# EAGLE board DAWA-MAIN-7.0 (EAGLE 9.5.0)
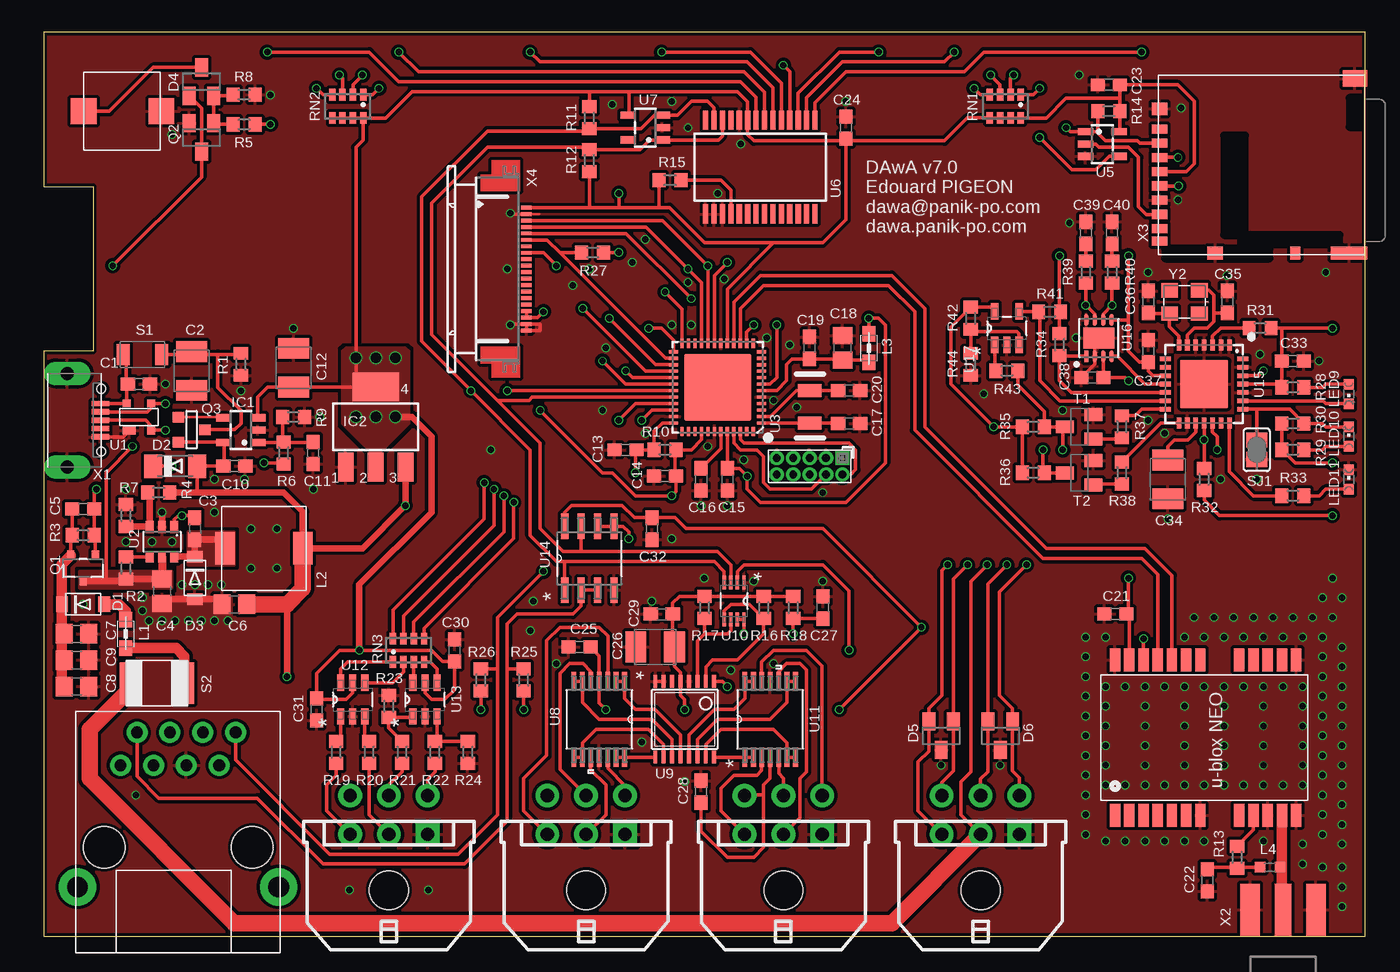
[diagram p5: board, top side]
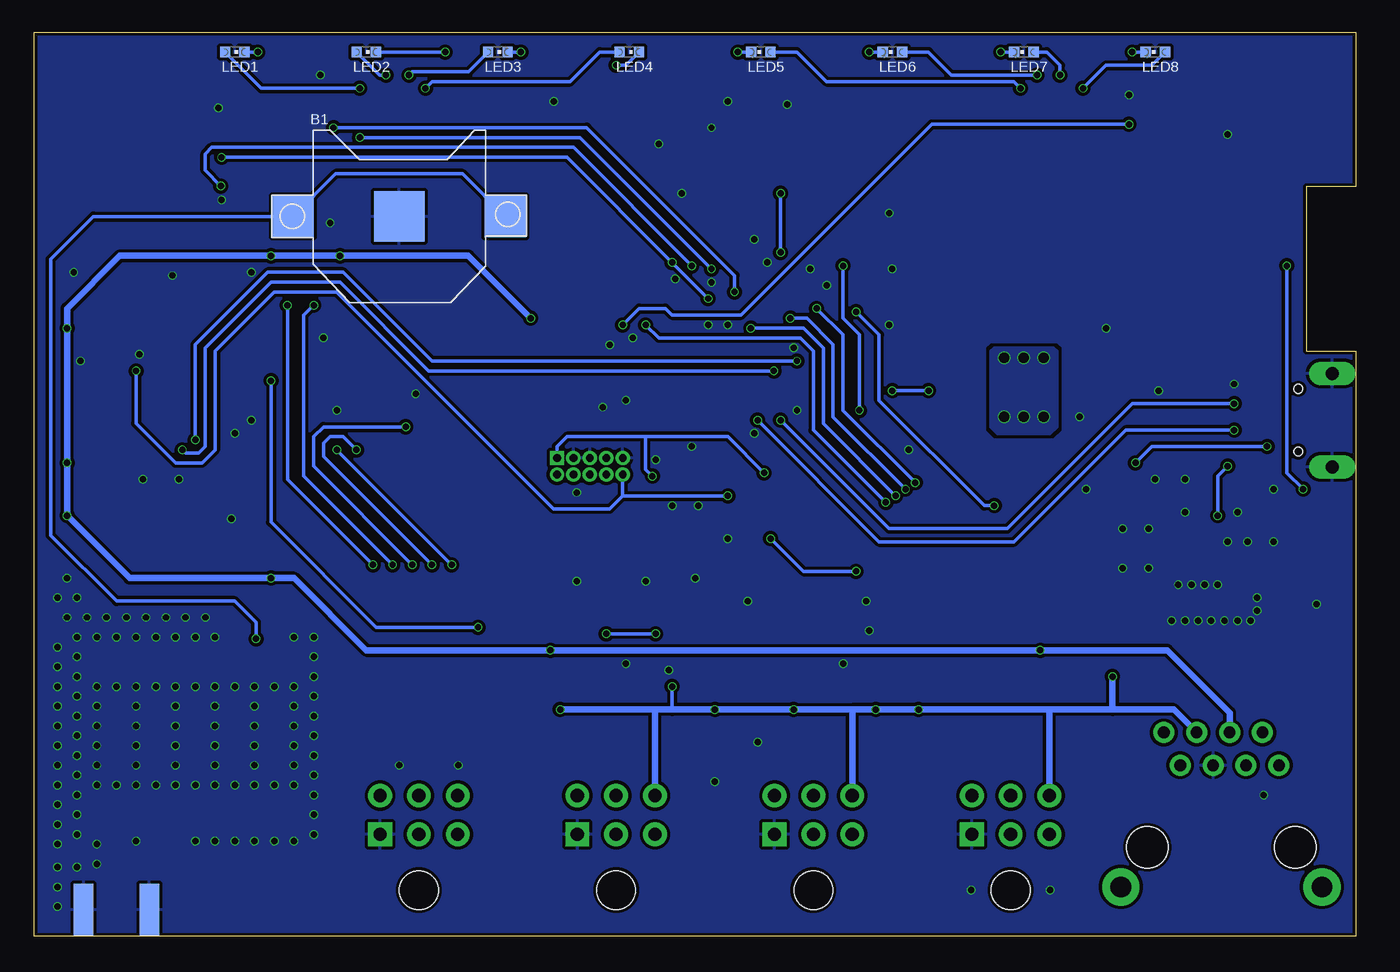
[diagram p6: board, bottom side, seen from below]

Size 102.11 x 69.85 mm. Coordinates in mm from the lower left corner, seen from the top.
Outline: 0,0 102.11,0 102.11,69.85 0,69.85 0,57.91 3.81,57.91 3.81,45.21 0,45.21 0,0
Copper layers (1*16): Top 0.035mm / dielectric 1.6mm / Bottom 0.035mm
Design rules "jlcpcb-2layers": minimum track width 5mil, minimum drill 0.3mm, track to track 5mil, track to pad 5mil, pad to pad 5mil, via to via 5mil, smd to smd 5mil, copper to edge 0.2mm, drill to drill 6mil, minimum pad ring 10mil, minimum via ring 3mil, stop-mask expansion 4mil, vias tented up to drill 0mil, thermal gap 10mil
Net classes: 0 default: width 0.203 mm, drill 0.406 mm, clearance 0.203 mm; 3 usbvcc: width 0.203 mm, drill 0.406 mm, clearance 0.203 mm; 4 USBpair: width 0.254 mm, drill 0.406 mm, clearance 0.61 mm

## Footprints (pad centres in the part's own frame; a part is rotated, then mirrored left to right if it is on the bottom)
CR1220-SMD = smd 3.2 x 3.2: +$1 -8.2,0; +$2 8.2,0 | smd 3.9 x 3.9: - 0,0
C0603 = smd 1.1 x 1: 1 -0.85,0; 2 0.85,0
SMC_B = smd 1.6 x 2.4: + -1.5,0; - 1.5,0
C0805 = smd 1.3 x 1.5: 1 -0.95,0; 2 0.95,0
SOD-123FL = smd 0.91 x 1.22: A 1.637,0; C -1.637,0
MINIMELF = smd 1.4 x 1.8: A 1.7,0; C -1.7,0
SOT23 = smd 1 x 1.4: 1 -0.95,-1.1; 2 0.95,-1.1; 3 0,1.1
SOT23-5 = smd 0.55 x 1.2: 1 -0.95,-1.3; 2 0,-1.3; 3 0.95,-1.3; 4 0.95,1.3; 5 -0.95,1.3
SOT223 = smd 1.219 x 2.235: 1 -2.311,-3.099; 2 0,-3.099; 3 2.311,-3.099 | smd 3.6 x 2.2: 4 0,3.099
ARDUINO_WIFI_SHIELD_V018_TG_PINHEAD_2X05_127 = drill 0.6 pad 1.016 square: 1 -0.635,2.54 | drill 0.6 pad 1.016: 2 0.635,2.54; 3 -0.635,1.27; 4 0.635,1.27; 5 -0.635,0; 6 0.635,0; 7 -0.635,-1.27; 8 0.635,-1.27; 9 -0.635,-2.54; 10 0.635,-2.54
WUERTH-ELEKTRONIK_0805 = smd 1.2 x 1: 1 -1.1,0; 2 1.1,0
SRR0604 = smd 1.5 x 2.5: P$1 3,0; P$2 -3,0
RC-MASTER-SMD_L0603 = smd 0.8 x 0.8: 1 -0.762,0; 2 0.762,0
CHIPLED_0603 = smd 0.8 x 0.8: A 0,-0.75; C 0,0.75
VISHAY_SI2369DS-T1-GE3_0 = smd 0.559 x 0.724: 1 -0.95,-0.984; 2 0.95,-0.984; 3 0,0.984
SOT-23 = smd 0.787 x 0.889: 1 0.025,-1.016; 2 -0.94,1.016; 3 0.991,1.016
R0603 = smd 1 x 1.1: 1 -0.85,0; 2 0.85,0
742-8NS = smd 0.5 x 0.9: 1 -1.2,-0.9; 2 -0.4,-0.9; 3 0.4,-0.9; 4 1.2,-0.9; 5 1.2,0.9; 6 0.4,0.9; 7 -0.4,0.9; 8 -1.2,0.9
MF-1206 = smd 1 x 1.6: 1 -2,0; 2 1,0
MF-1812 = smd 1.5 x 3.2: 1 -1,0; 2 3.25,0
SKPMAPE10 = smd 2 x 2: P$1 -3,0; P$2 3,0
SJ = smd 1.168 x 1.6: 1 -0.762,0; 2 0.762,0
SOT23-BEC = smd 1 x 1.4: B -0.95,-1.1; C 0,1.1; E 0.95,-1.1
SOT-143B = smd 1 x 0.6: 1 -0.75,-1.05 | smd 0.6 x 0.6: 2 0.95,-1.05; 3 0.95,1.05; 4 -0.95,1.05
SOT23-6 = smd 0.6 x 0.9: 1 -0.95,-1.15; 2 0,-1.15; 3 0.95,-1.15; 4 0.95,1.15; 5 0,1.15; 6 -0.95,1.15
QFN-48 = smd 0.7 x 0.25: 1 -3.4,2.75; 2 -3.4,2.25; 3 -3.4,1.75; 4 -3.4,1.25; 5 -3.4,0.75; 6 -3.4,0.25; 7 -3.4,-0.25; 8 -3.4,-0.75; 9 -3.4,-1.25; 10 -3.4,-1.75; 11 -3.4,-2.25; 12 -3.4,-2.75; 25 3.4,-2.75; 26 3.4,-2.25; 27 3.4,-1.75; 28 3.4,-1.25; 29 3.4,-0.75; 30 3.4,-0.25; 31 3.4,0.25; 32 3.4,0.75; 33 3.4,1.25; 34 3.4,1.75; 35 3.4,2.25; 36 3.4,2.75 | smd 0.25 x 0.7: 13 -2.75,-3.4; 14 -2.25,-3.4; 15 -1.75,-3.4; 16 -1.25,-3.4; 17 -0.75,-3.4; 18 -0.25,-3.4; 19 0.25,-3.4; 20 0.75,-3.4; 21 1.25,-3.4; 22 1.75,-3.4; 23 2.25,-3.4; 24 2.75,-3.4; 37 2.75,3.4; 38 2.25,3.4; 39 1.75,3.4; 40 1.25,3.4; 41 0.75,3.4; 42 0.25,3.4; 43 -0.25,3.4; 44 -0.75,3.4; 45 -1.25,3.4; 46 -1.75,3.4; 47 -2.25,3.4; 48 -2.75,3.4 | smd 5.15 x 5.15: EP 0,0
NEO-M8 = smd 1.8 x 0.8: 1 6.4,-7.4; 2 6.4,-6.3; 3 6.4,-5.2; 4 6.4,-4.1; 5 6.4,-3; 6 6.4,-1.9; 7 6.4,-0.8; 8 6.4,2.2; 9 6.4,3.3; 10 6.4,4.4; 11 6.4,5.5; 12 6.4,6.6; 13 -5.6,6.6; 14 -5.6,5.5; 15 -5.6,4.4; 16 -5.6,3.3; 17 -5.6,2.2; 18 -5.6,-0.8; 19 -5.6,-1.9; 20 -5.6,-3; 21 -5.6,-4.1; 22 -5.6,-5.2; 23 -5.6,-6.3; 24 -5.6,-7.4
SSOP28 = smd 0.4 x 1.5: 1 -4.225,-3.625; 2 -3.575,-3.625; 3 -2.925,-3.625; 4 -2.275,-3.625; 5 -1.625,-3.625; 6 -0.975,-3.625; 7 -0.325,-3.625; 8 0.325,-3.625; 9 0.975,-3.625; 10 1.625,-3.625; 11 2.275,-3.625; 12 2.925,-3.625; 13 3.575,-3.625; 14 4.225,-3.625; 15 4.225,3.625; 16 3.575,3.625; 17 2.925,3.625; 18 2.275,3.625; 19 1.625,3.625; 20 0.975,3.625; 21 0.325,3.625; 22 -0.325,3.625; 23 -0.975,3.625; 24 -1.625,3.625; 25 -2.275,3.625; 26 -2.925,3.625; 27 -3.575,3.625; 28 -4.225,3.625
SOP65P640X120-14N = smd 1.473 x 0.356: 1 -2.921,1.956; 2 -2.921,1.295; 3 -2.921,0.66; 4 -2.921,0; 5 -2.921,-0.66; 6 -2.921,-1.295; 7 -2.921,-1.956; 8 2.921,-1.956; 9 2.921,-1.295; 10 2.921,-0.66; 11 2.921,0; 12 2.921,0.66; 13 2.921,1.295; 14 2.921,1.956
ADC12_SD = smd 0.305 x 0.991: 1 -2.275,-2.918; 2 -1.625,-2.918; 3 -0.975,-2.918; 4 -0.325,-2.918; 5 0.325,-2.918; 6 0.975,-2.918; 7 1.625,-2.918; 8 2.275,-2.918; 9 2.275,2.918; 10 1.625,2.918; 11 0.975,2.918; 12 0.325,2.918; 13 -0.325,2.918; 14 -0.975,2.918; 15 -1.625,2.918; 16 -2.275,2.918
SOP50P310X90-8N = smd 1.067 x 0.254: 1 -1.422,0.762; 2 -1.422,0.254; 3 -1.422,-0.254; 4 -1.422,-0.762; 5 1.422,-0.762; 6 1.422,-0.254; 7 1.422,0.254; 8 1.422,0.762
SOT95P280X145-6N = smd 1.27 x 0.559: 1 -1.295,0.94; 2 -1.295,0; 3 -1.295,-0.94; 4 1.295,-0.94; 5 1.295,0; 6 1.295,0.94
SOIC127P600X175-8N = smd 1.981 x 0.559: 1 -2.464,1.905; 2 -2.464,0.635; 3 -2.464,-0.635; 4 -2.464,-1.905; 5 2.464,-1.905; 6 2.464,-0.635; 7 2.464,0.635; 8 2.464,1.905
QFN-28-S = smd 0.85 x 0.35: 1 -3,1.95; 2 -3,1.3; 3 -3,0.65; 4 -3,0; 5 -3,-0.65; 6 -3,-1.3; 7 -3,-1.95; 15 3,-1.95; 16 3,-1.3; 17 3,-0.65; 18 3,0; 19 3,0.65; 20 3,1.3; 21 3,1.95 | smd 0.35 x 0.85: 8 -1.95,-3; 9 -1.3,-3; 10 -0.65,-3; 11 0,-3; 12 0.65,-3; 13 1.3,-3; 14 1.95,-3; 22 1.95,3; 23 1.3,3; 24 0.65,3; 25 0,3; 26 -0.65,3; 27 -1.3,3; 28 -1.95,3 | smd 3.7 x 3.7: EXP 0,0
MICROCHIP_MCP2562T-E-MF_2 = smd 0.906 x 0.292: 1 -1.403,0.975; 2 -1.403,0.325; 3 -1.403,-0.325; 4 -1.403,-0.975; 5 1.403,-0.975; 6 1.403,-0.325; 7 1.403,0.325; 8 1.403,0.975 | smd 1.6 x 2.4: 9 0,0
SOT95P280X145-5N = smd 1.27 x 0.559: 1 -1.295,0.94; 2 -1.295,0; 3 -1.295,-0.94; 4 1.295,-0.94; 5 1.295,0.94
USB-MINIB-DAWA = smd 0.406 x 1.372: D+ 0,4.381; D- -0.641,4.381; GND 1.282,4.381; ID 0.641,4.381; VBUS -1.282,4.381 | drill 1 long: GND1 -3.612,1.826; GND2 3.612,1.826 | hole 0.7: -2.421,4.445; 2.421,4.445
SMA_EDGELAUNCH = smd 4.064 x 1.524: GND@1 2.032,-2.54; GND@2 2.032,2.54 | smd 4.064 x 1.524 bottom: GND@3 2.032,2.54; GND@4 2.032,-2.54 | smd 4.064 x 1.27: P 2.032,0
DM3AT-SF-PEJM5 = smd 0.7 x 1.2: 1 3.2,-0.1; 2 2.1,-0.1; 3 1,-0.1; 4 -0.1,-0.1; 5 -1.2,-0.1; 6 -2.3,-0.1; 7 -3.4,-0.1; 8 -4.5,-0.1; B -5.45,-0.1 | smd 1 x 0.8: A -6.4,-10.6 | smd 1 x 1.2: MOUNT0 4.75,-0.1; MOUNT1 -6.4,-4.4 | smd 1 x 2.8: MOUNT2 -6.4,-14.75 | smd 1.3 x 1.9: MOUNT3 7.1,-15.2
52745-2090 = smd 0.3 x 0.8: 1 -4.75,2.5; 2 -4.25,2.5; 3 -3.75,2.5; 4 -3.25,2.5; 5 -2.75,2.5; 6 -2.25,2.5; 7 -1.75,2.5; 8 -1.25,2.5; 9 -0.75,2.5; 10 -0.25,2.5; 11 0.25,2.5; 12 0.75,2.5; 13 1.25,2.5; 14 1.75,2.5; 15 2.25,2.5; 16 2.75,2.5; 17 3.25,2.5; 18 3.75,2.5; 19 4.25,2.5; 20 4.75,2.5
43045-0600 = drill 1.02 square: P$1 3,4.32 | drill 1.02: P$2 0,4.32; P$3 -3,4.32; P$4 3,7.32; P$5 0,7.32; P$6 -3,7.32 | hole 3: 0,0
RJ45 = drill 1.6: P$1 5.08,0.13; P$2 5.08,15.67 | drill 0.9: P$3 17.02,11.075; P$4 17.02,3.455; P$5 17.02,5.995; P$6 14.48,4.725; P$7 14.48,7.265; P$8 14.48,12.345; P$9 14.48,9.805; P$10 17.02,8.535 | hole 3.2: 8.14,2.185; 8.14,13.615
KANFLO_OSCILLATOR_SMD = smd 1 x 1.8: 1 0,0; 2 2.5,0
3.2X2.5_KX-7 = smd 1.3 x 1.1: 1 -1.15,-0.9; 2 1.15,-0.9; 3 1.15,0.9; 4 -1.15,0.9

## Placement (x,y rotation side)
B1  [CR1220-SMD]  73.91,55.63 0 bottom
C1  10nF  [C0603]  7.37,42.67 0 top
C2  10µF  [SMC_B]  11.43,43.69 270 top
C3  10nF  [C0603]  11.68,31.5 270 top
C4  10µF  [C0805]  9.14,26.67 270 top
C5  10nF  [C0603]  3.05,33.02 0 top
C6  10µF  [C0805]  14.73,25.65 180 top
C7  10µF  [C0805]  2.54,21.34 0 top
C8  10µF  [C0805]  2.54,19.3 0 top
C9  10µF  [C0805]  2.54,23.37 0 top
C10  0.1µF  [C0603]  14.73,36.32 0 top
C11  0.1µF  [C0603]  20.83,37.34 270 top
C12  10µF  [SMC_B]  19.3,43.94 90 top
C13  0.1µF  [C0603]  44.96,37.59 180 top
C14  0.1µF  [C0603]  48.01,35.56 180 top
C15  0.1µF  [C0603]  52.83,35.31 270 top
C16  0.1µF  [C0603]  50.8,35.31 270 top
C17  22pF  [C0603]  62.23,39.62 0 top
C18  10µF  [C0805]  61.72,45.47 90 top
C19  0.1µF  [C0603]  59.18,45.47 90 top
C20  22pF  [C0603]  62.23,42.16 0 top
C21  4.7µF  [C0603]  82.8,24.89 0 top
C22  47pF  [C0603]  89.92,4.32 90 top
C23  0.1µF  [C0603]  82.3,65.79 0 top
C24  0.1µF  [C0603]  61.98,62.48 90 top
C25  0.1µF  [C0603]  41.4,22.35 0 top
C26  1µF  [SMC_B]  47.24,22.35 180 top
C27  100pF  [C0603]  60.2,25.4 90 top
C28  0.1µF  [C0603]  50.8,11.18 90 top
C29  0.1µF  [C0603]  47.75,24.89 180 top
C30  0.1µF  [C0603]  31.75,22.1 90 top
C31  0.1µF  [C0603]  21.08,17.53 270 top
C32  0.1µF  [C0603]  46.99,31.5 270 top
C33  0.1µF  [C0603]  96.52,44.45 0 top
C34  10µF  [SMC_B]  86.87,35.31 270 top
C35  22pF  [C0603]  91.44,49.02 90 top
C36  22pF  [C0603]  85.34,49.02 90 top
C37  1µF  [C0603]  85.34,45.21 90 top
C38  1µF  [C0603]  81.03,43.18 180 top
C39  560pF  [C0603]  80.52,54.36 90 top
C40  560pF  [C0603]  82.55,54.36 90 top
D1  [SOD-123FL]  3.05,25.65 0 top
D2  [MINIMELF]  10.16,36.32 0 top
D3  [SOD-123FL]  11.68,27.69 270 top
D4  BAT54C  [SOT23]  12.19,66.04 0 top
D5  MMBZ27VAL  [SOT23]  69.34,15.49 180 top
D6  PESD1CAN  [SOT23]  73.91,15.49 180 top
IC1  LMV321M5  [SOT23-5]  15.24,39.12 90 top
IC2  NCP1117ST33T3G-3V3  [SOT223]  25.65,39.37 0 top
J1  [ARDUINO_WIFI_SHIELD_V018_TG_PINHEAD_2X05_127]  59.18,36.32 270 top
L1  [WUERTH-ELEKTRONIK_0805]  6.35,23.37 270 top
L2  10u SRR0604-100ML  [SRR0604]  17.02,29.97 180 top
L3  [WUERTH-ELEKTRONIK_0805]  63.75,45.47 90 top
L4  27nH  [RC-MASTER-SMD_L0603]  94.74,5.33 0 top
LED1  [CHIPLED_0603]  86.61,68.33 270 bottom
LED2  [CHIPLED_0603]  76.45,68.33 270 bottom
LED3  [CHIPLED_0603]  66.29,68.33 270 bottom
LED4  [CHIPLED_0603]  56.13,68.33 270 bottom
LED5  [CHIPLED_0603]  45.97,68.33 90 bottom
LED6  [CHIPLED_0603]  35.81,68.33 90 bottom
LED7  [CHIPLED_0603]  25.65,68.33 90 bottom
LED8  [CHIPLED_0603]  15.49,68.33 90 bottom
LED9  [CHIPLED_0603]  100.84,41.91 180 top
LED10  [CHIPLED_0603]  100.84,38.61 0 top
LED11  [CHIPLED_0603]  100.84,35.31 0 top
Q1  SI2369DS-T1-GE3VISHAY_SI2369DS-T1-GE3_0_0  [VISHAY_SI2369DS-T1-GE3_0]  3.05,28.45 180 top
Q2  BSS123  [SOT23]  12.19,61.72 180 top
Q3  FDN340P  [SOT-23]  11.43,39.12 90 top
R1  10k  [R0603]  15.24,44.2 90 top
R2  100k  [R0603]  6.35,28.45 90 top
R3  100k  [R0603]  3.05,30.99 180 top
R4  52k3  [R0603]  8.89,34.29 0 top
R5  330  [R0603]  15.49,62.74 180 top
R6  100k  [R0603]  18.54,37.34 90 top
R7  10k  [R0603]  6.35,32.51 270 top
R8  1M  [R0603]  15.49,65.02 180 top
R9  100k  [R0603]  19.3,40.13 0 top
R10  10k  [R0603]  48.01,37.59 180 top
R11  4.7k  [R0603]  42.16,63.25 90 top
R12  4.7k  [R0603]  42.16,59.94 270 top
R13  10  [R0603]  92.2,6.1 270 top
R14  10k  [R0603]  82.3,63.75 0 top
R15  10k  [R0603]  48.39,58.42 180 top
R16  4.7k  [R0603]  55.63,25.4 270 top
R17  4.7k  [R0603]  51.05,25.4 270 top
R18  200k  [R0603]  57.91,25.4 90 top
R19  4.7k  [R0603]  22.61,14.22 90 top
R20  4.7k  [R0603]  25.15,14.22 90 top
R21  1.8k  [R0603]  27.69,14.22 90 top
R22  1.8k  [R0603]  30.23,14.22 90 top
R23  1k  [R0603]  26.67,17.78 270 top
R24  1k  [R0603]  32.77,14.22 90 top
R25  1k  [R0603]  37.08,19.81 270 top
R26  1k  [R0603]  33.78,19.81 270 top
R27  10k  [R0603]  42.42,52.83 0 top
R28  100  [R0603]  96.52,42.42 0 top
R29  100  [R0603]  96.52,37.59 0 top
R30  100k  [R0603]  96.52,39.62 0 top
R31  100k  [R0603]  93.98,46.99 180 top
R32  1k  [R0603]  89.66,35.31 90 top
R33  100  [R0603]  96.52,34.04 0 top
R34  1k  [R0603]  78.49,45.72 270 top
R35  510 0.5W  [R0603]  76.45,39.37 180 top
R36  510 0.5W  [R0603]  76.45,35.81 180 top
R37  1k  [R0603]  83.31,39.37 270 top
R38  1k  [R0603]  83.31,35.81 270 top
R39  100  [R0603]  80.52,51.31 90 top
R40  100  [R0603]  82.55,51.31 90 top
R41  10k  [R0603]  77.72,48.26 180 top
R42  10k  [R0603]  71.63,47.75 90 top
R43  10k  [R0603]  74.42,43.69 0 top
R44  10k  [R0603]  71.63,44.2 90 top
RN1  100  [742-8NS]  74.3,64.14 180 top
RN2  100  [742-8NS]  23.5,64.14 180 top
RN3  510  [742-8NS]  28.19,22.1 0 top
S1  [MF-1206]  8.13,44.96 0 top
S2  [MF-1812]  7.62,19.56 0 top
S3  SKPMAPE10  [SKPMAPE10]  6.1,63.75 180 top
SJ1  [SJ]  93.73,37.59 90 top
T1  [SOT23-BEC]  80.01,39.37 90 top
T2  [SOT23-BEC]  80.01,35.81 90 top
U1  PRTR5V0U2X  [SOT-143B]  7.37,40.13 0 top
U2  LM2734Y  [SOT23-6]  9.14,30.48 180 top
U3  ATSAMD21G-M  [QFN-48]  52.07,42.42 180 top
U4  NEO-M8  [NEO-M8]  90.17,15.75 270 top
U5  74AHC1G125DBV  [SOT23-5]  81.79,61.21 270 top
U6  MCP23017SS  [SSOP28]  55.37,59.44 180 top
U7  24AA02E48OT  [SOT23-5]  46.48,62.48 90 top
U8  TLV2374IPWR  [SOP65P640X120-14N]  42.93,16.76 270 top
U9  ADC128D818  [ADC12_SD]  49.53,16.76 180 top
U10  PCA9306DCUT  [SOP50P310X90-8N]  53.34,25.91 270 top
U11  TLV2374IPWR  [SOP65P640X120-14N]  56.13,16.76 90 top
U12  SN74LVC2G17DBVR  [SOT95P280X145-6N]  23.88,18.29 90 top
U13  SN74LVC2G17DBVR  [SOT95P280X145-6N]  29.46,18.29 90 top
U14  P82B96D  [SOIC127P600X175-8N]  42.16,29.21 90 top
U15  STN2100  [QFN-28-S]  89.66,42.67 270 top
U16  MCP2562T-E-MFMICROCHIP_MCP2562T-E-MF_0_2  [MICROCHIP_MCP2562T-E-MF_2]  81.53,46.23 90 top
U17  TL331IDBVR  [SOT95P280X145-5N]  74.42,46.99 90 top
X1  [USB-MINIB-DAWA]  0,39.88 270 top
X2  [SMA_EDGELAUNCH]  95.76,0 90 top
X3  DM3AT-SF-PEJM5  [DM3AT-SF-PEJM5]  86.11,59.18 90 top
X4  52745-2090  [52745-2090]  34.8,51.56 270 top
X5  [43045-0600]  57.15,3.56 0 top
X6  RJ45  [RJ45]  18.29,-1.27 90 top
X7  [43045-0600]  72.39,3.56 0 top
X8  [43045-0600]  41.91,3.56 0 top
X9  [43045-0600]  26.67,3.56 0 top
Y1  CM7V-T1A  [KANFLO_OSCILLATOR_SMD]  59.18,42.16 270 top
Y2  16Mhz  [3.2X2.5_KX-7]  88.14,49.02 180 top

## Tracks (layer width: path | path; a pad name or v marks a point on that pad's centre or on a via)
+3V3  (via drill 0.5, 0.8)
  Top 0.254: U13.5 29.46,18.8 29.97,18.29 30.99,18.29 31.75,19.05 C30.1 30.82,21.25 29.97,22.1 v24.38,22.1 22.86,22.1 21.08,20.32 C31.1 21.17,18.29 23.37,18.29 23.88,18.8 U12.5 | U15.25 95.42,42.67 R28.1 C33.1 95.67,46.99 | 83.15,64.77 C23.2 87.63,65.79 88.9,64.52 88.9,59.69 88.29,59.08 X3.4 | 83.15,64.77 R14.2 83.15,62.22 U5.5 | U3.44 C15.1 53.76,36.16 v54.36,35.56 54.36,34.54 55.37,33.53 61.98,33.53 65.02,36.58 65.02,47.24 64.52,47.75 v63.75,47.75 L3.2 | RN2.5 RN2.6 RN2.7 RN2.8 | C24.1 61.81,61.47 54.86,61.47 54.4,61.94 U6.9 54.4,64.47 53.59,65.28 45.21,65.28 | C24.1 62.14,61.47 69.6,61.47 71.37,63.25 RN1.5 RN1.6 RN1.7 RN1.8 77.46,63.23 78.99,64.77 83.15,64.77 | RN2.8 26.41,63.23 28.45,65.28 42.16,65.28 | 45.21,65.28 42.16,65.28 | v99.57,36.58 96.69,36.58 R29.1 R30.1 | v99.57,32.51 90.84,32.51 89.66,33.69 R32.1 | v99.57,46.99 95.67,46.99 | v83.82,52.58 83.82,47.63 | U16.5 83.82,47.63 | R31.1 95.67,46.99 | R34.1 78.49,48.17 R41.1 78.49,48.35 v78.49,52.58 | X4.1 42.16,56.31 | 42.16,56.31 44.45,56.31 | 44.45,56.31 47.54,56.31 | 47.54,56.31 48.34,56.31 51.05,53.59 56.39,53.59 | R15.2 47.54,56.31 | U3.17 52.82,50.03 56.39,53.59 | C24.1 61.98,55.37 60.2,53.59 56.39,53.59 | v44.45,52.83 R27.2 | v44.45,57.4 44.45,56.31 | U10.2 53.59,28.19 54.1,28.7 60.2,28.7 62.23,26.67 v62.23,22.1 | IC1.3 16.54,41.69 17.3,42.44 C12.+ 24.13,42.44 v24.13,44.7 24.13,60.96 24.7,61.52 RN2.8 | U3.36 47.8,39.67 47.16,39.03 R10.2 C13.1 45.72,37.5 v45.72,35.81 | 83.82,47.63 83.82,45.21 84.67,44.36 C37.1 85.34,43.69 85.71,43.32 U15.10 | U4.23 83.87,24.89 C21.2 83.82,24.89 v83.82,27.69 | U7.4 45.21,63.46 45.21,65.28
  Top 0.254: R11.2 42.16,65.28 | R12.2 42.16,56.31
  Top 0.508: v24.38,22.1 24.38,27.18 29.97,32.77 29.97,38.61 28.45,40.13 v27.18,40.13
  Bottom 0.254: v44.45,57.4 v44.45,52.83 | 54.86,38.61 48.51,38.61 v45.72,35.81 | 54.86,38.61 60.96,38.61 61.72,37.85 J1.1 | v54.36,35.56 54.86,36.07 54.86,38.61
  Bottom 0.508: v63.75,47.75 68.58,52.58 v78.49,52.58 v83.82,52.58 95.5,52.58 99.57,48.51 v99.57,46.99 v99.57,36.58 v99.57,32.51 94.74,27.69 v83.82,27.69 82.04,27.69 76.45,22.1 v62.23,22.1 v24.38,22.1 14.58,22.1 9.75,17.27 X6.P$10
  other vias: 25.65,44.7 27.18,44.7 25.65,40.13 24.13,40.13
  pour Top (no thermals): 25.65,37.08 23.11,39.62 23.11,45.21 23.37,45.47 27.94,45.47 28.19,45.21 28.19,39.62
  pour Bottom: 27.94,45.47 23.37,45.47 23.11,45.21 23.11,39.37 23.62,38.86 27.69,38.86 28.19,39.37 28.19,45.21
+5V  (via drill 0.5)
  Top 0.254: Q3.2 IC1.5 13.94,36.32 C10.1 D2.A 11.86,34.29 11.94,34.29 | v52.83,19.3 52.45,19.68 U9.1 | R18.2 R16.1 R17.1 49.11,26.25 48.6,25.74 C29.1 48.6,22.49 C26.+ 48.74,20.85 49.2,20.39 U9.5 49.2,18.61 49.53,18.29 v49.53,17.53 | U16.3 81.86,43.2 C38.1 83.57,43.18 v83.82,42.93 | X4.17 X4.18 37.85,47.81 38.16,47.81 v38.61,48.26 | v43.43,17.53 42.93,18.03 U8.4 42.93,21.68 C25.2 | C28.1 50.8,8.13 52.83,6.1 54.86,6.1 55.63,6.86 55.63,10.92 | v61.47,17.53 v67.82,23.88 60.2,31.5 49.62,31.5 48.77,32.35 C32.1 45.63,32.35 44.7,33.27 40.77,33.27 40.26,32.77 U14.8 | U11.4 56.13,12.19 55.63,11.68 55.63,10.92 | X5.P$6 54.2,10.92 55.63,10.92 | R26.2 v33.78,17.53 | R25.2 v37.08,17.53
  Top 0.508: IC2.3 27.96,33.3 v27.94,33.27 24.64,29.97 L2.P$2 20.02,32.81 18.54,34.29 11.94,34.29 R4.2 | v18.8,20.07 18.8,25.65
  Top 1.27: C6.1 18.8,25.65 20.02,26.88 L2.P$2
  Bottom 0.254: v52.83,19.3 52.83,17.53 | v38.61,48.26 36.83,46.48 36.83,41.4 28.7,33.27 v27.94,33.27 | v83.82,42.93 83.82,32 75.69,23.88 v67.82,23.88
  Bottom 0.508: 38.91,17.53 v43.43,17.53 v49.53,17.53 52.83,17.53 54.15,17.53 | 54.15,17.53 v61.47,17.53 | X8.P$6 38.91,17.53 | X5.P$6 54.15,17.53 | X9.P$6 23.67,17.53 | 23.67,17.53 v33.78,17.53 v37.08,17.53 38.91,17.53 | X6.P$5 14.07,17.53 18.8,17.53 | 18.8,17.53 23.67,17.53 | v18.8,20.07 18.8,17.53
+12V  (via drill 0.5)
  Top 0.254: U17.5 73.48,48.6 R42.2 70.1,47.08 70.1,42.67 v73.41,39.37 R35.2 R36.2 | v72.9,28.7 71.63,27.43 71.63,12.7 70.87,11.94 70.87,9.4 X7.P$2
  Top 1.27: X7.P$2 65.53,1.02 14.73,1.02 3.56,12.19 3.56,15.99 6.62,19.05 S2.1
  Bottom 0.254: v73.41,39.37 79.76,39.37 80.52,38.61 80.52,36.32 v72.9,28.7
ANA_1
  Top 0.254: U11.3 55.47,12.8 55.12,12.45 53.34,12.45 52.32,11.43 52.32,9.7 X5.P$3
ANA_2
  Top 0.254: U11.5 56.79,12.57 57.15,12.22 X5.P$5
ANA_3
  Top 0.254: U11.10 56.79,20.47 57.4,21.08 58.42,21.08 58.93,20.57 58.93,12.7 58.42,12.19 58.42,9.15 X5.P$2
ANA_4
  Top 0.254: U11.12 55.47,21.18 56.39,22.1 58.93,22.1 60.15,20.88 X5.P$4
ANA_5
  Top 0.254: U8.3 43.59,23.22 42.93,23.88 39.88,23.88 38.86,22.86 38.86,13.97 37.08,12.19 37.08,9.7 X8.P$3
ANA_6
  Top 0.254: U8.5 42.27,20.47 41.66,21.08 40.64,21.08 39.88,20.32 39.88,12.91 X8.P$5
ANA_7
  Top 0.254: X8.P$2 43.43,9.4 43.43,11.68 42.27,12.85 U8.10
ANA_8
  Top 0.254: U8.12 43.59,12.96 44.91,11.64 X8.P$4
BOOST  (via drill 0.5)
  Top 0.254: U2.1 10.09,32.19 10.41,32.51 v10.67,32.51 11.52,32.51 C3.1 | v9.91,36.32 D2.C
  Bottom 0.254: v10.67,32.51 10.67,35.56 v9.91,36.32
CAN_HI  (via drill 0.5)
  Top 0.254: R39.1 v80.52,48.77 81.21,48.08 U16.7 | X7.P$5 72.39,12.15 72.96,12.72 D6.2 72.96,27.24 v74.42,28.7
  Bottom 0.254: v74.42,28.7 81.28,35.56 81.28,48.01 v80.52,48.77
CAN_LOW  (via drill 0.5)
  Top 0.254: R40.1 v82.55,48.77 81.86,48.08 U16.6 | X7.P$4 75.39,12.24 74.86,12.77 D6.1 74.86,17.61 73.85,18.63 73.85,26.6 v75.95,28.7
  Bottom 0.254: v75.95,28.7 82.55,35.31 v82.55,48.77
CMP
  Top 0.254: IC1.1 18.54,38.17 | 18.54,38.17 20.81,38.17 C11.1 | R9.1 18.45,38.28 R6.2 18.54,38.17
DIGI_1
  Top 0.254: X9.P$4 29.67,12.14 30.23,12.7 R22.1
DIGI_2
  Top 0.254: X9.P$5 26.67,11.68 27.69,12.7 R21.1
EN
  Top 0.254: R2.2 8.16,29.3 U2.4
FB
  Top 0.508: R7.2 8.16,31.66 U2.3 8.19,34.14 R4.1
GATE_CMD
  Top 0.203: Q3.3 13.9,40.11 IC1.4
GND  (via drill 0.5)
  Top 0.203: X4.2 38.29,55.81
  Top 0.254: U9.8 U9.7 | X1.GND 6.13,38.6 U1.1 | C38.2 81.21,44.21 U16.2 81.21,45.9 U16.9 | X4.2 36.14,55.81 v36.07,55.88 | X4.19 X4.20 38.35,46.81 38.35,47.31 X4.19 | X4.19 36.14,47.31 v36.07,47.24
  Top 0.508: C4.2 9.47,26.05 D3.A 13.39,26.05 C6.2 | U2.2 v9.14,32.77
  other vias: 82.04,19.3 82.04,17.78 82.04,16.26 82.04,14.73 82.04,13.21 82.04,11.68 83.57,19.3 86.61,19.3 89.66,19.3 92.71,19.3 95.76,19.3 85.09,19.3 85.09,17.78 85.09,16.26 85.09,14.73 85.09,13.21 85.09,11.68 83.57,11.68 88.14,19.3 91.19,19.3 94.23,19.3 97.28,19.3 97.28,17.78 97.28,16.26 97.28,14.73 97.28,13.21 97.28,11.68 95.76,11.68 94.23,11.68 92.71,11.68 91.19,11.68 89.66,11.68 88.14,11.68 86.61,11.68 88.14,13.21 88.14,14.73 88.14,16.26 88.14,17.78 91.19,17.78 91.19,16.26 91.19,14.73 91.19,13.21 94.23,13.21 94.23,14.73 94.23,16.26 94.23,17.78 98.81,12.45 98.81,10.92 98.81,9.4 98.81,7.87 97.28,7.11 94.23,7.37 97.28,5.59 98.81,5.33 100.33,5.33 100.33,3.81 100.33,2.29 80.52,12.45 80.52,10.92 80.52,9.4 80.52,7.87 82.04,7.37 83.57,7.37 85.09,7.37 86.61,7.37 88.14,7.37 89.66,7.37 80.52,13.97 80.52,15.49 80.52,17.02 98.81,13.97 98.81,15.49 98.81,17.02 98.81,18.54 98.81,20.07 98.81,21.59 98.81,23.11 97.28,23.11 95.76,23.11 94.23,23.11 92.71,23.11 91.19,23.11 89.66,23.11 87.88,64.01 88.14,23.11 80.52,18.54 80.52,20.07 80.52,21.59 80.52,23.11 82.04,23.11 99.57,24.64 98.04,24.64 96.52,24.64 95,24.64 93.47,24.64 91.95,24.64 90.42,24.64 88.9,24.64 98.81,26.16 100.33,26.16 99.57,27.69 100.33,11.68 100.33,10.16 100.33,8.64 100.33,7.11 100.33,13.21 100.33,14.73 100.33,16.26 100.33,17.78 100.33,19.3 100.33,20.83 100.33,22.35 53.85,61.21 35.81,51.56 46.23,14.99 49.78,62.48 13.21,24.38 9.14,24.38 7.62,25.15 10.67,27.18 12.7,27.18 13.72,27.18 11.68,27.18 10.16,24.38 11.18,24.38 12.19,24.38 14.22,24.38 7.62,26.16 6.35,34.54 13.21,32.77 13.21,35.31 15.49,35.31 6.35,30.48 52.07,57.4 80.01,66.55 87.63,56.9 93.73,35.31 98.55,44.45 91.44,51.05 85.34,51.31 72.64,41.91 86.87,32.26 86.61,38.86 93.98,44.96 69.34,13.21 73.91,13.21 52.58,50.8 56.39,41.4 46.48,38.86 51.31,37.85 52.83,33.27 50.8,33.27 48.51,30.73 54.86,27.43 60.2,27.43 46.99,25.91 39.62,21.08 9.91,61.98 17.53,65.02 15.24,42.16 19.3,46.99 9.4,42.67 21.34,40.13 20.83,34.54 79.25,55.12 61.98,64.52 79.76,46.23 78.74,40.64 49.53,11.94 53.09,20.57 56.39,21.08 51.05,27.69 37.85,25.91 37.59,23.62 99.06,51.31 60.2,34.29 54.1,36.83 58.17,40.89 57.66,45.72 55.88,46.23 43.43,45.47 43.18,40.64 34.54,37.59 40.89,50.29 43.94,64.26 48.51,64.52 85.34,39.88 90.93,35.31 42.16,51.56 48.51,47.24 50.04,47.24 45.47,52.07 46.48,53.85 49.78,50.55 7.11,10.92 23.62,3.56 29.72,3.56 16,31.5 18.03,31.5 18.03,28.45 16,28.45 8.38,30.48 9.91,30.48 3.05,25.65 8.13,24.38
  pour Top (isolate 0.254, rank 2): 0,69.85 0,57.91 3.81,57.91 3.81,45.21 0,45.21 0,0 102.11,0 102.11,69.85
  pour Bottom (isolate 0.254, rank 2): 0,69.85 0,57.91 3.81,57.91 3.81,45.21 0,45.21 0,0 102.11,0 102.11,69.85
  pour Top (no thermals): 8.13,26.16 14.48,26.16 14.48,24.64 8.13,24.64
GPIO_I_DIGI_1  (via drill 0.5)
  Top 0.254: RN3.5 29.39,23.81 36.32,30.73 v36.32,33.53 | U3.14 54.32,46.7 v54.86,47.24
  Bottom 0.254: v54.86,47.24 53.85,46.23 42.93,46.23 41.91,45.21 41.91,39.12 v36.32,33.53
GPIO_I_DIGI_2  (via drill 0.5)
  Top 0.254: U3.25 48.67,46.07 47.75,46.99 v46.74,46.99 | RN3.6 28.59,24.28 35.56,31.24 v35.56,34.04
  Bottom 0.254: v46.74,46.99 42.67,46.99 41.15,45.47 41.15,39.62 v35.56,34.04
GPIO_I_SQR_1  (via drill 0.5)
  Top 0.254: U3.27 47.27,44.17 v43.69,47.75 | RN3.7 27.79,24.75 34.8,31.75 v34.8,34.54
  Bottom 0.254: v34.8,34.54 40.39,40.13 40.39,45.72 42.42,47.75 v43.69,47.75
GPIO_I_SQR_2  (via drill 0.5)
  Top 0.254: U3.28 46.5,43.67 v41.66,48.51 | RN3.8 26.99,25.22 34.04,32.26 v34.04,35.05
  Bottom 0.254: v34.04,35.05 39.62,40.64 39.62,46.48 v41.66,48.51
I2C_SCL_3V3
  Top 0.254: U6.12 52.45,61.84 52.14,61.53 U7.1 46.8,61.53 46.06,60.79 R12.1 42,60.96 34.29,60.96 29.97,56.64 29.97,46.48 35.29,41.16 35.31,41.16 | U10.3 53.09,28.7 52.07,29.72 41.53,29.72 | U3.32 37.75,41.67 37.49,41.41 35.05,41.41 35.31,41.16 | 35.31,41.16 38.35,38.11 38.35,31.5 40.13,29.72 41.53,29.72 | U14.7 41.53,29.72
I2C_SCL_5V
  Top 0.254: U9.3 50.51,22.82 51.05,23.37 | 51.05,23.37 R17.2 | U10.6 53.09,23.62 52.83,23.37 51.05,23.37
I2C_SCL_BUFFERED  (via drill 0.5)
  Top 0.254: U14.6 U14.5 44.78,31.67 45.21,31.24 v45.21,30.73 | X6.P$4 14.83,13.62 22.1,6.35 32,6.35 35.05,9.4 35.05,20.66 | v38.61,28.19 35.05,24.64 35.05,20.66 | R26.1 35.05,20.66
  Bottom 0.254: v38.61,28.19 42.67,28.19 v45.21,30.73
I2C_SDA_3V3  (via drill 0.5)
  Top 0.254: U10.4 52.58,28.19 51.82,28.96 40.26,28.96 | U6.13 51.8,64.03 51.31,64.52 50.04,64.52 48.96,63.43 U7.3 47.18,63.43 46.14,62.4 R11.1 42,62.23 34.29,62.23 29.21,57.15 29.21,45.97 v33.02,42.16 37.59,37.59 37.59,30.99 39.62,28.96 40.26,28.96 | v35.81,42.16 v35.82,42.17 U3.31 | U14.1 40.26,28.96
  Bottom 0.254: v35.81,42.16 v33.02,42.16
I2C_SDA_5V
  Top 0.254: U10.5 52.58,25.15 53.09,25.65 54.52,25.65 R16.2 55.63,23.37 53.59,21.34 51.66,21.34 51.16,20.83 U9.2
I2C_SDA_BUFFERED
  Top 0.254: U14.3 U14.2 41.53,25.53 40.89,24.89 36.58,24.89 35.81,24.13 35.81,20.66 | 35.81,20.66 35.81,8.89 32.51,5.59 21.59,5.59 16.51,10.67 8.89,10.67 7.21,12.35 X6.P$3 | R25.1 35.81,20.66
ISO_K_TX
  Top 0.254: U15.14 84.84,40.73 84.33,40.22 R37.1
ISO_L_TX
  Top 0.254: R38.1 86.32,39.67 U15.15
ISO_RX
  Top 0.254: U15.13 78.52,41.37 76.96,42.93 76.96,48.17 R41.2 76.85,48.28 U17.4
K-LINE  (via drill 0.5)
  Top 0.254: v78.74,37.59 78.74,39.2 T1.C R35.1 77.3,40.55 75.27,42.58 R43.2 | X7.P$3 67.56,9.7 67.56,13.46 68.39,14.29 D5.2 68.39,17.61 69.41,18.63 69.41,28.26 v69.85,28.7
  Bottom 0.254: v78.74,37.59 v69.85,28.7
L-LINE  (via drill 0.5)
  Top 0.254: T2.C R36.1 77.22,35.9 v77.22,37.59 | X7.P$6 69.39,11.89 70.29,12.79 D5.1 70.29,27.62 v71.37,28.7
  Bottom 0.254: v71.37,28.7 79.76,37.08 79.76,38.1 79.25,38.61 78.23,38.61 v77.22,37.59
MASTER-RESET  (via drill 0.5)
  Top 0.254: U3.40 50.82,38.37 50.04,37.59 R10.1 48.77,37.5 48.77,35.56 C14.1 48.86,34.38 v48.51,34.04 45.72,34.04 43.94,35.81 43.18,35.81 v38.35,40.64 | U15.26 93.87,43.32 v94.23,43.69 | X4.8 38.63,52.81 v39.62,51.82
  Bottom 0.254: v94.23,43.69 94.23,39.62 91.19,36.58 89.15,36.58 88.14,37.59 88.14,45.21 83.57,49.78 78.74,49.78 61.98,33.02 57.66,33.02 56.64,34.04 | J1.10 56.64,34.04 | 56.64,34.04 v48.51,34.04 | v39.62,51.82 39.62,47.75 38.35,46.48 v38.35,40.64
N$1
  Top 0.254: U3.43 52.32,37.68 C16.1
N$2
  Top 0.254: U3.1 Y1.2 61.34,39.66 C17.1
N$3
  Top 0.254: U3.2 56.17,40.17 58.17,42.16 Y1.1 C20.1
N$5  (via drill 0.5)
  Top 0.254: v84.84,68.33 72.64,68.33 71.12,66.8 61.98,66.8 59.6,64.42 U6.1
  Bottom 0.254: LED1.C v84.84,68.33
N$6  (via drill 0.5)
  Top 0.254: U4.22 v84.97,22.99
  Bottom 0.254: v84.97,22.99 84.97,24.26 86.61,25.91 95.76,25.91 100.84,30.99 100.84,52.32 97.54,55.63 B1.+$1 78.81,58.93 69.02,58.93 B1.+$2
N$7  (via drill 0.5)
  Top 0.254: v70.36,68.33 69.6,67.56 61.72,67.56 58.95,64.79 U6.2
  Bottom 0.254: LED2.C v70.36,68.33
N$8
  Top 0.254: Q1.2 2.1,30.89 R3.2 C5.1
  Top 0.813: Q1.2 1.41,28.74 D1.C 1.41,23.37 | 1.41,23.37 1.41,21.34 | 1.41,21.34 1.41,19.3 C8.1 | C9.1 1.41,23.37 | C7.1 1.41,21.34
N$9  (via drill 0.5)
  Top 0.254: RN1.1 76.47,65.03 v76.96,65.53
  Bottom 0.254: v76.96,65.53 84.57,65.53 LED1.A
N$10
  Top 0.813: D1.A 5.84,25.65 6.35,25.15 L1.1
N$11
  Top 0.254: L4.1 92.29,5.33 | 92.29,5.33 R13.2 | C22.2 90.08,5.33 92.29,5.33
N$12  (via drill 0.5)
  Top 0.254: RN1.2 74.69,66.31 v74.93,66.55
  Bottom 0.254: LED2.A 77.2,68.31 75.44,66.55 v74.93,66.55
N$13
  Top 0.254: U5.2 81.28,61.21 81.53,60.96 83.82,60.96 84.58,60.2 84.58,56.39 85.19,55.78 X3.7
N$14  (via drill 0.5)
  Top 0.254: v47.75,68.33 54.61,68.33 57,65.94 U6.5
  Bottom 0.254: LED5.C v47.75,68.33
N$15  (via drill 0.5)
  Top 0.254: U10.7 U10.8 v54.1,23.37 | v57.91,23.37 R18.1 C27.1
  Bottom 0.254: v54.1,23.37 v57.91,23.37
N$16  (via drill 0.5)
  Top 0.254: v37.59,68.33 38.35,67.56 54.36,67.56 56.35,65.57 U6.6
  Bottom 0.254: LED6.C v37.59,68.33
N$17  (via drill 0.5)
  Top 0.254: v27.43,68.33 28.96,66.8 54.1,66.8 55.7,65.21 U6.7
  Bottom 0.254: LED7.C v27.43,68.33
N$18  (via drill 0.5)
  Top 0.254: v17.27,68.33 25.15,68.33 27.43,66.04 53.85,66.04 55.05,64.84 U6.8
  Bottom 0.254: LED8.C v17.27,68.33
N$19
  Top 0.254: U4.9 93.47,8.21 R13.1
N$20
  Top 0.813: U4.11 95.67,5.33 | 95.67,5.33 95.67,2.12 X2.P | L4.2 95.67,5.33
N$21  (via drill 0.5)
  Top 0.254: RN1.3 73.89,65.81 v73.15,66.55
  Bottom 0.254: v73.15,66.55 72.9,66.8 68.57,66.8 LED3.A
N$22  (via drill 0.5)
  Top 0.254: v64.52,68.33 61.47,68.33 58.3,65.16 U6.3
  Bottom 0.254: LED3.C v64.52,68.33
N$23  (via drill 0.5)
  Top 0.254: v57.15,67.31 57.66,66.8 57.66,63.07 U6.4
  Bottom 0.254: LED4.C 56.4,67.31 v57.15,67.31
N$24  (via drill 0.5)
  Top 0.254: RN1.4 72.38,65.03 v71.88,65.53
  Bottom 0.254: v71.88,65.53 71.37,66.04 60.71,66.04 58.42,68.33 LED4.A
N$25  (via drill 0.5)
  Top 0.254: RN2.1 25.41,65.03 v25.91,65.53
  Bottom 0.254: v25.91,65.53 26.42,66.04 40.89,66.04 43.18,68.33 LED5.A
N$26  (via drill 0.5)
  Top 0.254: RN2.2 23.89,65.81 v24.64,66.55
  Bottom 0.254: LED6.A 33.02,68.33 31.24,66.55 v24.64,66.55
N$27
  Top 0.254: U11.2 U11.1 U9.16
N$28
  Top 0.254: U11.7 U11.6 57.43,14.96 56.39,16 52.32,16 51.16,14.83 U9.15
N$29  (via drill 0.5)
  Top 0.254: RN2.3 23.09,66.31 v22.86,66.55
  Bottom 0.254: LED7.A 23.89,68.33 22.86,67.3 v22.86,66.55
N$30  (via drill 0.5)
  Top 0.254: RN2.4 21.58,65.03 v21.08,65.53
  Bottom 0.254: v21.08,65.53 19.3,67.31 15.75,67.31 14.74,68.31 LED8.A
N$31
  Top 0.254: U9.14 50.51,15.2 52.07,16.76 56.13,16.76 57.43,18.06 U11.9 U11.8
N$32
  Top 0.254: U15.22 93.73,40.72 | SJ1.2 93.73,40.72 | 93.73,40.72 96.27,40.72 R30.2 98.81,39.62 99.07,39.36 LED10.C
N$33
  Top 0.254: R37.2 83.21,38.42 T1.B
N$34
  Top 0.254: U6.18 53.1,57.65 52.32,58.42 R15.1
N$35
  Top 0.254: U9.13 49.85,15.56 51.82,17.53 53.34,17.53 54.18,18.36 U11.14 U11.13
N$36
  Top 0.254: U12.6 22.94,20.65 23.48,21.2 RN3.1
N$37
  Top 0.813: S2.2 10.87,21.64 10.24,22.27 L1.2
N$38
  Top 0.254: U8.8 U8.9 41.63,14.96 42.67,16 46.74,16 47.91,14.83 U9.10
N$39
  Top 0.254: U9.11 48.55,15.2 46.99,16.76 42.93,16.76 41.63,18.06 U8.6 U8.7
N$40
  Top 0.254: U9.12 49.2,15.56 47.24,17.53 45.72,17.53 44.88,18.36 U8.1 U8.2
N$41
  Top 0.254: U12.1 22.94,16 22.94,15.4 R19.2
N$42
  Top 0.254: U12.3 24.82,15.4 R20.2
N$43
  Top 0.254: R24.2 R22.2 30.4,15.25 U13.3
N$44
  Top 0.254: R21.2 26.67,16.09 R23.2 28.46,16.93 U13.1
N$45
  Top 0.254: RN3.3 28.59,19.65 U13.6
N$46
  Top 0.254: RN3.4 29.86,21.2 30.4,20.65 U13.4
N$47  (via drill 0.5)
  Top 0.254: D4.1 12.19,63.99 Q2.3 12.19,58.67 v5.33,51.82 | Q1.1 4,30.89 R3.1 C5.2 3.9,34.38 v4.06,34.54
  Bottom 0.254: v5.33,51.82 5.33,35.81 v4.06,34.54
N$48
  Top 0.254: D4.3 8.47,67.14 5.08,63.75 S3.P$2
N$49
  Top 0.254: U12.4 26.95,19.58 27.79,20.43 RN3.2
N$50
  Top 0.254: R8.2 14.56,64.94 13.21,64.94 | 13.21,64.94 D4.2 | R5.2 13.23,62.74 Q2.1 13.14,64.87 13.21,64.94
N$51
  Top 0.254: U8.13 U8.14 U9.9
N$52
  Top 0.254: R38.2 81.21,34.96 T2.B
N$53
  Top 0.254: U17.3 75.36,46.56 75.18,46.74 71.79,46.74 R42.1 R44.2
N$54
  Top 0.254: U17.1 73.48,43.78 R43.1
N$56
  Top 0.254: U15.3 90.31,46.37 90.93,46.99 R31.2
N$57
  Top 0.254: 90.42,48.17 90.42,49.53 90.03,49.92 Y2.1 | 90.42,48.17 90.42,47.5 89.92,46.99 88.9,46.99 88.36,46.45 U15.6 | C35.1 90.42,48.17
N$58
  Top 0.254: C36.1 85.39,48.12 Y2.3 86.99,47.11 87.71,46.38 U15.7
N$60
  Top 0.254: R28.2 98.82,42.42 99.06,42.66 LED9.A
N$61
  Top 0.254: U15.17 89.01,38.97 88.39,38.35 87.38,38.35 86.87,37.85 C34.+
N$62
  Top 0.254: U15.21 91.61,35.9 93.47,34.04 R33.1
N$63
  Top 0.254: LED11.A 99.06,34.56 98.54,34.04 R33.2
N$64
  Top 0.254: LED10.A 99.07,37.86 98.81,37.59 R29.2
N$66
  Top 0.254: LED9.C 99.06,41.16 98.85,41.37 U15.23
N$67
  Top 0.254: R39.2 C39.1
N$68
  Top 0.254: R40.2 C40.1
POWER_CTRL  (via drill 0.5)
  Top 0.254: U3.7 56.13,42.67 56.64,43.18 v56.64,47.24 | v17.53,62.74 R5.1
  Bottom 0.254: v56.64,47.24 55.37,48.51 53.34,48.51 52.83,48.01 47.5,48.01 32.77,62.74 v17.53,62.74
RX_CAN
  Top 0.254: U15.11 85.09,42.67 82.94,44.83 U16.4
SERIAL1_RX_GPS
  Top 0.254: U4.20 87.17,27.89 85.09,29.97 77.47,29.97 68.07,39.37 68.07,48.51 65.53,51.05 55.37,51.05 53.32,49 U3.16
SERIAL1_TX_GPS
  Top 0.254: U3.15 53.82,48.49 55.63,50.29 65.28,50.29 67.31,48.26 67.31,39.12 77.22,29.21 84.84,29.21 86.07,27.98 U4.21
SERIAL2_RX_OBD2  (via drill 0.5)
  Top 0.254: U15.19 90.31,38.97 90.68,38.61 v90.68,37.59 | U3.29 45.48,43.17 v44.96,43.69
  Bottom 0.254: v90.68,37.59 90.42,37.34 89.41,37.34 88.9,37.85 88.9,45.47 83.82,50.55 78.49,50.55 71.63,43.69 v44.96,43.69
SERIAL2_TX_OBD2  (via drill 0.5)
  Top 0.254: U15.18 v89.66,38.35 R32.2 | U3.30 44.96,42.67 v43.18,44.45
  Bottom 0.254: v89.66,38.35 89.66,45.72 84.07,51.31 78.23,51.31 71.37,44.45 v43.18,44.45
SPI_CS_SDCARD  (via drill 0.5)
  Top 0.254: 81.45,62.06 81.35,62.16 U5.1 79.31,62.16 v78.99,62.48 | R14.1 81.45,62.06 | X3.2 84.68,61.28 84.5,61.47 82.04,61.47 81.45,62.06 | U3.24 49.32,48.47 v48.01,49.78
  Bottom 0.254: v48.01,49.78 48.01,51.05 59.44,62.48 v78.99,62.48
SPI_CS_TFT
  Top 0.254: U3.26 48.04,44.67 39.88,52.83 | X4.6 38.9,53.81 39.88,52.83 | R27.1 39.88,52.83
SPI_MISO  (via drill 0.5)
  Top 0.254: X4.4 46.53,54.81 v49.78,51.56 50.82,50.53 U3.21 | U5.4 82.33,60.26 81.31,59.25 79.44,59.25 v76.96,61.72
  Bottom 0.254: v49.78,51.56 59.94,61.72 v76.96,61.72
SPI_MOSI  (via drill 0.5)
  Top 0.254: X4.5 45,54.31 v50.04,49.28 | U3.19 51.82,51.06 v52.83,52.07 | v87.63,60.2 86.22,60.2 X3.3
  Bottom 0.254: v87.63,60.2 60.96,60.2 v52.83,52.07 v50.04,49.28
SPI_SCK  (via drill 0.5)
  Top 0.254: X4.3 47.81,55.31 v51.32,51.8 U3.20 | X3.5 v87.7,57.98
  Bottom 0.254: v51.32,51.8 51.32,51.83 60.45,60.96 88.39,60.96 88.9,60.45 88.9,59.18 v87.7,57.98
SQR_1
  Top 0.254: X9.P$2 25.15,9.4 R20.1
SQR_2
  Top 0.254: X9.P$3 21.84,9.7 21.84,11.68 22.61,12.45 R19.1
SW
  Top 0.508: U2.6 D3.C C3.2 14.02,30.65 L2.P$1
  pour Top (no thermals): 11.18,31.24 14.73,31.24 14.73,28.7 11.18,28.7
SWCLK
  Top 0.254: J1.4 59.31,34.54 56.13,34.54 55.63,35.05 55.63,37.08 55.12,37.59 53.85,37.59 53.32,38.12 U3.45
SWDIO
  Top 0.254: U3.46 53.82,38.38 54.1,38.1 62.23,38.1 62.74,37.59 62.74,36.07 62.36,35.69 J1.2
TX_CAN
  Top 0.254: U15.12 79.39,42.02 78.49,42.93 R34.2 78.53,44.83 U16.1
USB_D+  (via drill 0.5)
  Top 0.254: X1.D+ 7.87,39.88 8.32,39.44 U1.2 8.35,39.12 v9.4,39.12 | U3.34 47.02,40.67 v46.23,39.88
  Bottom 0.254: v9.4,39.12 17.78,39.12 26.42,30.48 36.83,30.48 v46.23,39.88
USB_D-  (via drill 0.5)
  Top 0.254: X1.D- 8.01,40.52 8.32,40.83 U1.3 8.35,41.15 v9.4,41.15 | U3.33 45.74,41.17 v44.45,39.88
  Bottom 0.254: v9.4,41.15 17.27,41.15 26.92,31.5 36.07,31.5 v44.45,39.88
USBVCC
  Top 0.254: Q3.1 14.76,39.14 15.24,39.62 15.24,40.64 13.46,42.42 13.46,44.96 | S1.2 11.43,44.96 | 11.43,44.96 13.46,44.96 | 13.46,44.96 15.15,44.96 R1.2 | C2.+ 11.43,44.96
VDDANA
  Top 0.254: U3.6 56.65,42.17 57.4,42.93 57.4,44.2 57.82,44.62 C19.1 60.71,44.62 61.62,44.62 C18.1 63.6,44.52 L3.1
VIN  (via drill 0.5)
  Top 0.254: 4.83,27.46 4.83,35.81 v6.86,37.85 | v17.02,36.58 18.45,36.58 R6.1
  Top 0.508: C4.1 9.12,27.6 R2.1 6.22,27.46 4.83,27.46 Q1.3
  Top 0.61: U2.5 C4.1
  Bottom 0.254: v6.86,37.85 15.75,37.85 v17.02,36.58
  pour Top (no thermals): 9.91,28.19 2.79,28.19 2.79,26.92 9.91,26.92
VUSB
  Top 0.254: X1.VBUS 6.39,41.16 U1.4 6.42,42.57 C1.1 6.38,42.81 6.38,44.7 S1.1

## Text on the board
tNames: DAwA v7.0 / Edouard PIGEON / dawa@panik-po.com / dawa.panik-po.com